# Altium schematic sheet AL422B.SchDoc
size A4
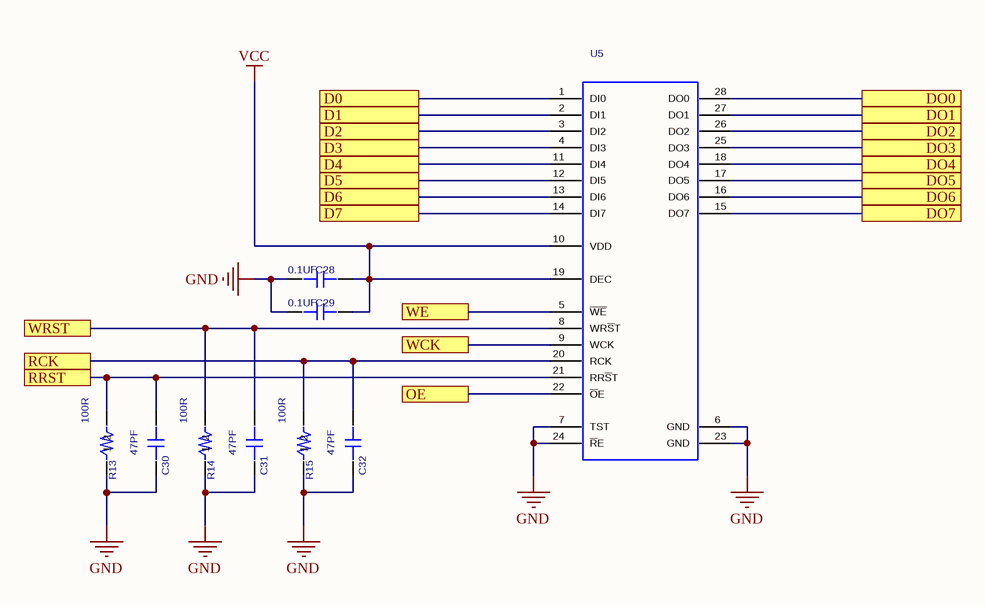
[diagram p0: AL422B.SchDoc]

## Parts
C28  value 0.1UF  [SC0402]  (hidden comment: CAP_0.1UF_0402_FIRE)
C29  value 0.1UF  [SC0402]  (hidden comment: CAP_0.1UF_0402_FIRE)
C30  value 47PF  [SC0402]  (hidden comment: CAP_47PF_0402_FIRE)
C31  value 47PF  [SC0402]  (hidden comment: CAP_47PF_0402_FIRE)
C32  value 47PF  [SC0402]  (hidden comment: CAP_47PF_0402_FIRE)
R13  value 100R  [SR0402]  (hidden comment: RES_100R_0402_FIRE)
R14  value 100R  [SR0402]  (hidden comment: RES_100R_0402_FIRE)
R15  value 100R  [SR0402]  (hidden comment: RES_100R_0402_FIRE)
U5  AL422B_FIRE  [AL422B(28PINS)]  (value not drawn)

## Ports
D0, D1, D2, D3, D4, D5, D6, D7, DO0, DO1, DO2, DO3, DO4, DO5, DO6, DO7, OE, RCK, RRST, WCK, WE, WRST

## Nets
GND: C28.2 C29.2 C30.1 C31.1 C32.1 R13.1 R14.1 R15.1 U5.6(GND) U5.7(TST) U5.23(GND) U5.24(~{R}E)
VCC: C28.1 C29.1 U5.10(VDD) U5.19(DEC)
D0: U5.1(DI0) ; port D0
D1: U5.2(DI1) ; port D1
D2: U5.3(DI2) ; port D2
D3: U5.4(DI3) ; port D3
D4: U5.11(DI4) ; port D4
D5: U5.12(DI5) ; port D5
D6: U5.13(DI6) ; port D6
D7: U5.14(DI7) ; port D7
DO0: U5.28(DO0) ; port DO0
DO1: U5.27(DO1) ; port DO1
DO2: U5.26(DO2) ; port DO2
DO3: U5.25(DO3) ; port DO3
DO4: U5.18(DO4) ; port DO4
DO5: U5.17(DO5) ; port DO5
DO6: U5.16(DO6) ; port DO6
DO7: U5.15(DO7) ; port DO7
OE: U5.22(~{O}E) ; port OE
RCK: C32.2 R15.2 U5.20(RCK) ; port RCK
RRST: C30.2 R13.2 U5.21(RR~{S}T) ; port RRST
WCK: U5.9(WCK) ; port WCK
WE: U5.5(~{WE}) ; port WE
WRST: C31.2 R14.2 U5.8(WR~{S}T) ; port WRST

## Library data of the parts
C28 C29 = CAP_0.1UF_0402_FIRE: 0402; Manufacture 1 P/N: 0.1uF(0402); PCB DECAL: SC0402
C30-C32 = CAP_47PF_0402_FIRE: Manufacture 1 P/N: 47PF(0402); PCB DECAL: SC0402
R13-R15 = RES_100R_0402_FIRE: 100R(0402); Assembly: SMD; PCB DECAL: SR0402
U5 = AL422B_FIRE: AL422B; Manufacture 1 P/N: AL422B; Value: AL422B; PCB DECAL: AL422B(28PINS)